# Altium schematic sheet DI_improved.SchDoc
size A4; SheetNumber: 3; SheetTotal: 10
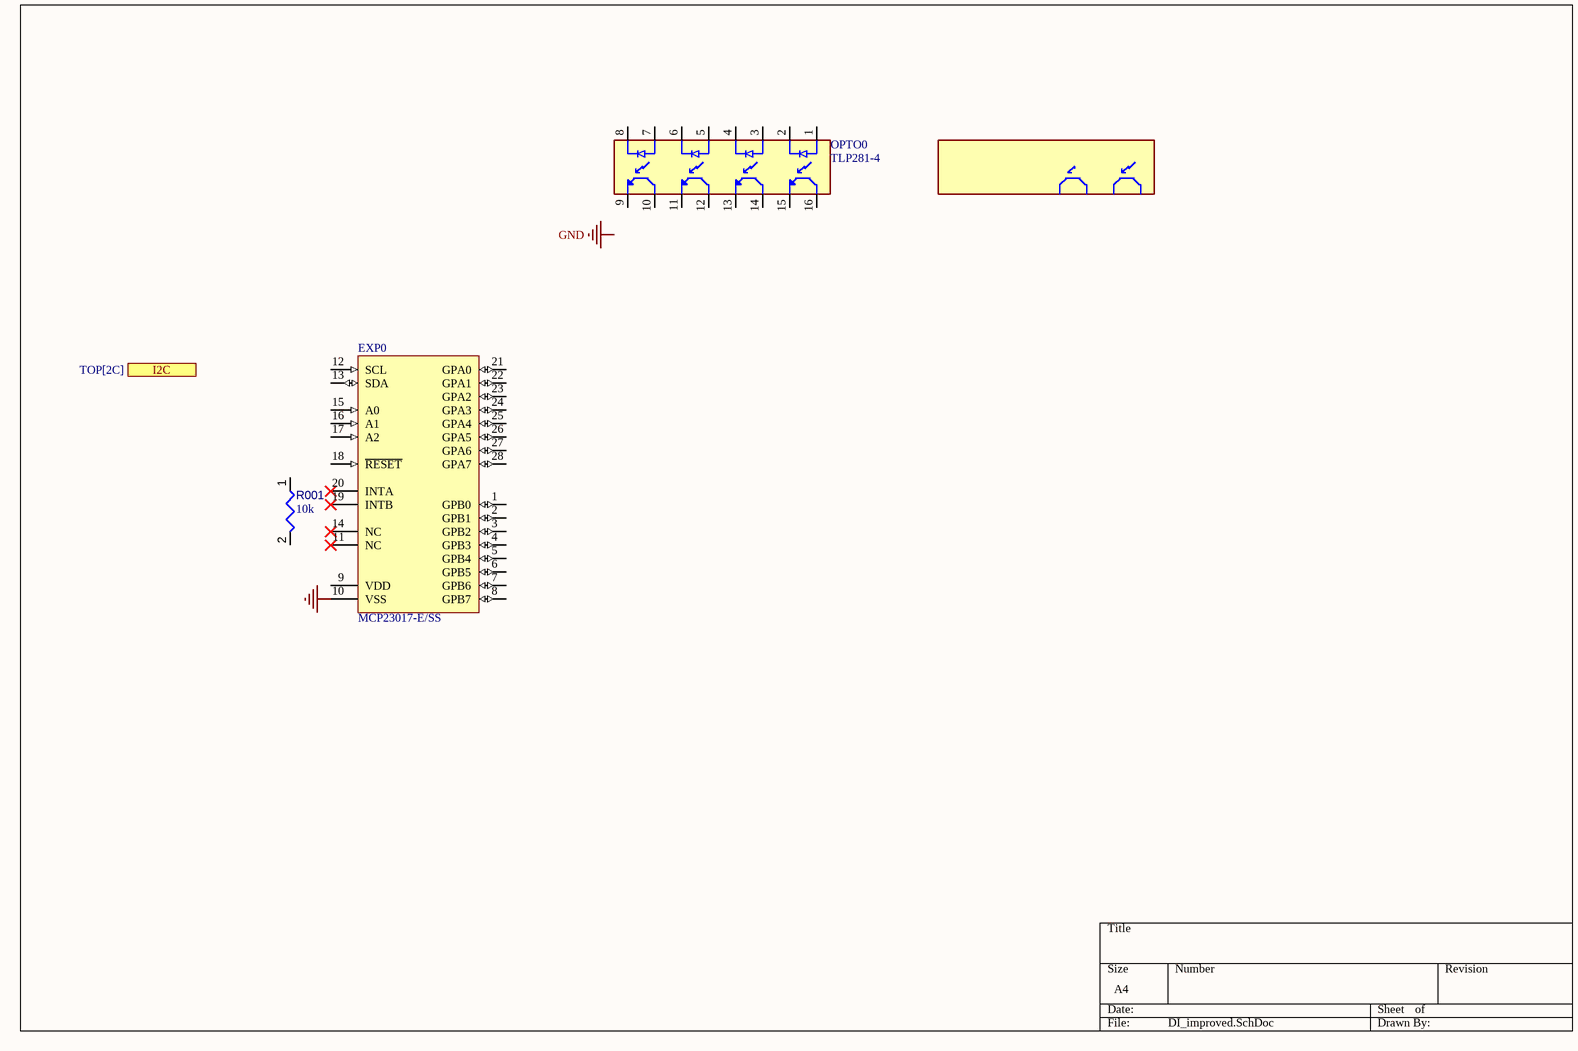
[diagram p0: DI_improved.SchDoc]

## Parts
?  (no value)
EXP0  MCP23017-E/SS  [SSOP-SS28_M]
OPTO0  TLP281-4  [SOIC127P700X210-16N]
R001  value 10k  [RESC0402(1005)_L]  (hidden comment: 10KR2F)

## Ports
I2C (harness I2C, see TOP[2C])

## Nets
GND: EXP0.10(VSS)

Not connected (* = marked no-connect by the designer): EXP0 1(GPB0) 2(GPB1) 3(GPB2) 4(GPB3) 5(GPB4) 6(GPB5) 7(GPB6) 8(GPB7) 9(VDD) 11(NC)* 12(SCL) 13(SDA) 14(NC)* 15(A0) 16(A1) 17(A2) 18(~{RESET}) 19(INTB)* 20(INTA)* 21(GPA0) 22(GPA1) 23(GPA2) 24(GPA3) 25(GPA4) 26(GPA5) 27(GPA6) 28(GPA7); OPTO0 1(A1) 2(C1) 3(A2) 4(C2) 5(A3) 6(C3) 7(A4) 8(C4) 9(ET4) 10(CT4) 11(ET3) 12(CT3) 13(ET2) 14(CT2) 15(ET1) 16(CT1); R001 1 2

## Notes on the sheet
- Labels drawn without touching a wire or pin: GND

## Library data of the parts
? = CMP-007-000000-1: Optoisolator Transistor Output 2500Vrms 4 Channel 16-SOP
EXP0 = CMP-015-00008-1: I²C Bus IC Operating temperature: -40...+125 °C Power supply: 1.8...5.5 V Package: SSOP-20; Max Supply Voltage: 5.5V; Min Supply Voltage: 4.5V; Max Operating Temperature: 125°C; Case/Package: SSOP; Min Operating Temperature: -40°C; Pins: 28; Mounting Technology: Surface Mount
OPTO0 = CMP-007-000000-1: Optoisolator Transistor Output 2500Vrms 4 Channel 16-SOP; MF: Toshiba Semiconductor; Package: SOP-16 Toshiba; Value: *; Component Type: Standard; Source: TLP281-4.SchLib; Pin Count: 16; Check_prices: https://www.snapeda.com/parts/TLP281-4/Toshiba/view-part/?ref=eda; SnapEDA_Link: https://www.snapeda.com/parts/TLP281-4/Toshiba/view-part/?ref=snap; Design Item ID: TLP281-4; MP: TLP281-4
R001 = CMP-009-00066-2: 10K 0.063W 1% 0402 (1005 Metric)  SMD; Power: 63mW; Case/Package: 0402; Mounting Technology: SMT; Pins: 2; Tolerance: 1%